# EAGLE design GCtoUSBv1_1 (EAGLE 5.11)
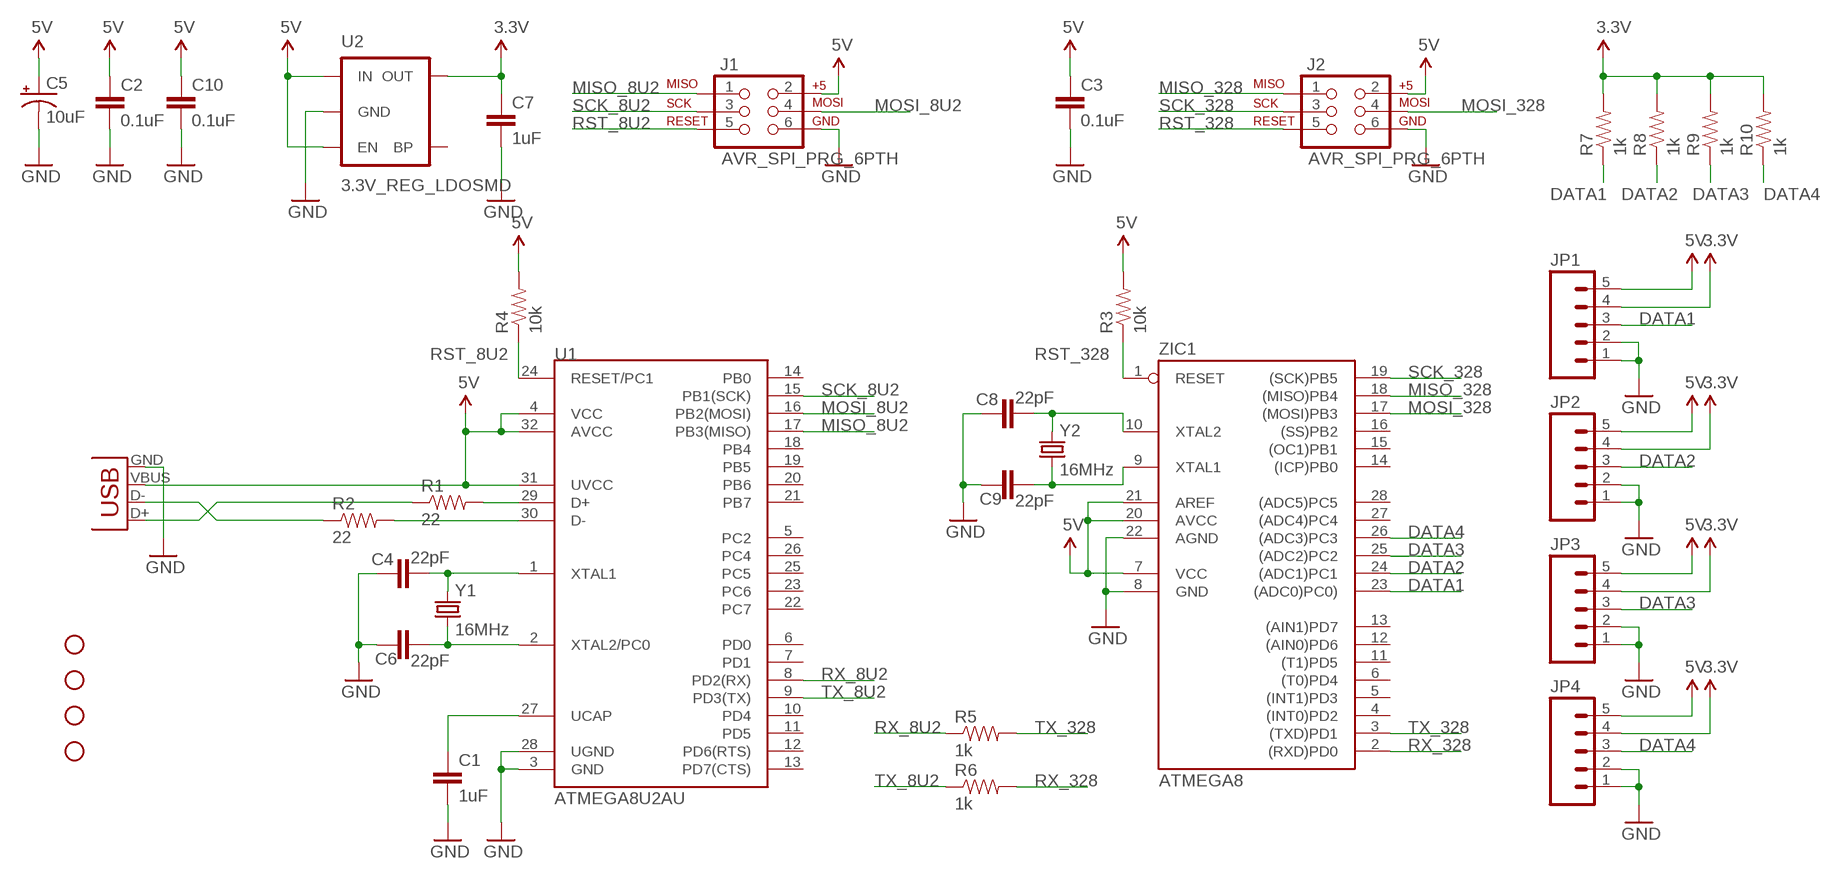
[diagram p0: schematic, sheet 1]

## Parts
C1  1uF  CAPPTH1  [CAP-PTH-5MM]
C2  0.1uF  CAPPTH  [CAP-PTH-SMALL]
C3  0.1uF  CAPPTH  [CAP-PTH-SMALL]
C4  22pF  CAPPTH  [CAP-PTH-SMALL]
C5  10uF  CAP_POLPTH2  [CPOL-RADIAL-10UF-25V]
C6  22pF  CAPPTH  [CAP-PTH-SMALL]
C7  1uF  CAPPTH1  [CAP-PTH-5MM]
C8  22pF  CAPPTH  [CAP-PTH-SMALL]
C9  22pF  CAPPTH  [CAP-PTH-SMALL]
C10  0.1uF  CAPPTH  [CAP-PTH-SMALL]
J1  AVR_SPI_PRG_6PTH  [2X3]
J2  AVR_SPI_PRG_6PTH  [2X3]
JP1  M05PTH  [1X05]
JP2  M05PTH  [1X05]
JP3  M05PTH  [1X05]
JP4  M05PTH  [1X05]
JP5  STAND-OFF  [STAND-OFF]
JP6  STAND-OFF  [STAND-OFF]
JP7  STAND-OFF  [STAND-OFF]
JP8  STAND-OFF  [STAND-OFF]
R1  22  RESISTORPTH-1/4W  [AXIAL-0.4]
R2  22  RESISTORPTH-1/4W  [AXIAL-0.4]
R3  10k  RESISTORPTH-1/2W  [AXIAL-0.5]
R4  10k  RESISTORPTH-1/2W  [AXIAL-0.5]
R5  1k  RESISTORPTH-1/2W  [AXIAL-0.5]
R6  1k  RESISTORPTH-1/2W  [AXIAL-0.5]
R7  1k  RESISTORPTH-1/2W  [AXIAL-0.5]
R8  1k  RESISTORPTH-1/2W  [AXIAL-0.5]
R9  1k  RESISTORPTH-1/2W  [AXIAL-0.5]
R10  1k  RESISTORPTH-1/2W  [AXIAL-0.5]
U1  ATMEGA8U2AU  [TQFP32-08]
U2  3.3V_REG_LDOSMD  V_REG_LDOSMD  [SOT23-5]
X1  USBSMD  [USB-MINIB]
Y1  16MHz  CRYSTALHC49US  [HC49US]
Y2  16MHz  CRYSTALHC49US  [HC49US]
ZIC1  ATMEGA8  AT90S4433P  [DIL28-3]

## Nets
3.3V: C7.1 JP1.4 JP2.4 JP3.4 JP4.4 R7.P$2 R8.P$2 R9.P$2 R10.P$2 U2.5(OUT)
5V: C2.1 C3.1 C5.1(+) C10.1 J1.2 J2.2 JP1.5 JP2.5 JP3.5 JP4.5 R3.P$2 R4.P$2 U1.4(VCC) U1.31(UVCC) U1.32(AVCC) U2.1(IN) U2.3(EN) X1.VBUS ZIC1.7(VCC) ZIC1.20(AVCC) ZIC1.21(AREF)
DATA1: JP1.3 R7.P$1 ZIC1.23((ADC0)PC0))
DATA2: JP2.3 R8.P$1 ZIC1.24((ADC1)PC1)
DATA3: JP3.3 R9.P$1 ZIC1.25((ADC2)PC2)
DATA4: JP4.3 R10.P$1 ZIC1.26((ADC3)PC3)
GND: C1.2 C2.2 C3.2 C4.2 C5.2(-) C6.2 C7.2 C8.2 C9.2 C10.2 J1.6 J2.6 JP1.1 JP1.2 JP2.1 JP2.2 JP3.1 JP3.2 JP4.1 JP4.2 U1.3(GND) U1.28(UGND) U2.2(GND) X1.GND ZIC1.8(GND) ZIC1.22(AGND)
MISO_8U2: J1.1 U1.17(PB3(MISO))
MISO_328: J2.1 ZIC1.18((MISO)PB4)
MOSI_8U2: J1.4 U1.16(PB2(MOSI))
MOSI_328: J2.4 ZIC1.17((MOSI)PB3)
N$1: C8.1 Y2.2 ZIC1.10(XTAL2)
N$2: C9.1 Y2.1 ZIC1.9(XTAL1)
N$3: R1.P$2 U1.29(D+)
N$4: R2.P$2 U1.30(D-)
N$5: R1.P$1 X1.D+
N$6: R2.P$1 X1.D-
N$8: C4.1 U1.1(XTAL1) Y1.2
N$9: C6.1 U1.2(XTAL2/PC0) Y1.1
N$12: C1.1 U1.27(UCAP)
RST_8U2: J1.5 R4.P$1 U1.24(RESET/PC1)
RST_328: J2.5 R3.P$1 ZIC1.1(RESET)
RX_8U2: R5.P$1 U1.8(PD2(RX))
RX_328: R6.P$2 ZIC1.2((RXD)PD0)
SCK_8U2: J1.3 U1.15(PB1(SCK))
SCK_328: J2.3 ZIC1.19((SCK)PB5)
TX_8U2: R6.P$1 U1.9(PD3(TX))
TX_328: R5.P$2 ZIC1.3((TXD)PD1)
Unconnected: U1.5(PC2) U1.6(PD0) U1.7(PD1) U1.10(PD4) U1.11(PD5) U1.12(PD6(RTS)) U1.13(PD7(CTS)) U1.14(PB0) U1.18(PB4) U1.19(PB5) U1.20(PB6) U1.21(PB7) U1.22(PC7) U1.23(PC6) U1.25(PC5) U1.26(PC4) U2.4(BP) ZIC1.4((INT0)PD2) ZIC1.5((INT1)PD3) ZIC1.6((T0)PD4) ZIC1.11((T1)PD5) ZIC1.12((AIN0)PD6) ZIC1.13((AIN1)PD7) ZIC1.14((ICP)PB0) ZIC1.15((OC1)PB1) ZIC1.16((SS)PB2) ZIC1.27((ADC4)PC4) ZIC1.28((ADC5)PC5)

## Library data of the parts
C1-C4 C6-C10 = SparkFun:CAP: Capacitor Standard 0603 ceramic capacitor, and 0.1" leaded capacitor.
C5 = SparkFun:CAP_POL: Capacitor Polarized These are standard SMD and PTH capacitors. Normally 10uF, 47uF, and 100uF in electrolytic and tantalum varieties. Always verify the external diameter of the through hole cap, it varies with capacity, voltage, and manufacturer. The EIA devices should be standard.
J1 J2 = SparkFun:AVR_SPI_PRG_6: AVR ISP 6 Pin This is the reduced ISP connector for AVR programming. Common on Arduino. This footprint will take up less PCB space and can be used with a 10-pin to 6-pin adapter such as SKU: BOB-08508
JP1-JP4 = SparkFun:M05: Header 5 Standard 5-pin 0.1" header. Use with straight break away headers (SKU : PRT-00116), right angle break away headers (PRT-00553), swiss pins (PRT-00743), machine pins (PRT-00117), and female headers (PRT-00115). Molex polarized connector foot print use with SKU : PRT-08230 with associated crimp pins and housings.
JP5-JP8 = SparkFun:STAND-OFF: Stand Off This is the mechanical footprint for a #4 phillips button head screw. Use the keepout ring to avoid running the screw head into surrounding components. SKU : PRT-00447
R1-R10 = SparkFun:RESISTOR: Resistor Basic schematic elements and footprints for 0603, 1206, and PTH resistors.
U1 = SparkFun:ATMEGA8U2: Atmel 8-bit Microcontroller with 8/16/32K Bystes of ISP Flash and USB Controller. ATmega8U2, ATmega16U2, and ATmega32U2
U2 = SparkFun:V_REG_LDO: Voltage Regulator LDO Standard 150mA LDO voltage regulator in SOT-23 layout. Micrel part MIC5205. BP (by-pass) pin is used to lower output noise with 470pF cap.
X1 = SparkFun:USB: USB Connectors USB-B-PTH is fully proven SKU : PRT-00139 USB-miniB is fully proven SKU : PRT-00587 USB-A-PCB is untested. USB-A-H is throughly reviewed, but untested. Spark Fun Electronics SKU : PRT-00437 USB-B-SMT is throughly reviewed, but untested. Needs silkscreen touching up. USB-A-S has not been used/tested USB-MB-H has not been used/tested
Y1 Y2 = SparkFun:CRYSTAL: Crystals Various standard crystals. Proven footprints. Spark Fun Electronics SKU : COM-00534
ZIC1 = atmel:AT90S4433: MICROCONTROLLER 4 Kbytes FLASH 128 bytes SRAM 256 bytes EEPROM UART 6-channel 10 bit ADC

## Net classes
0 default: width 0.203 mm, clearance 0.203 mm

## Board
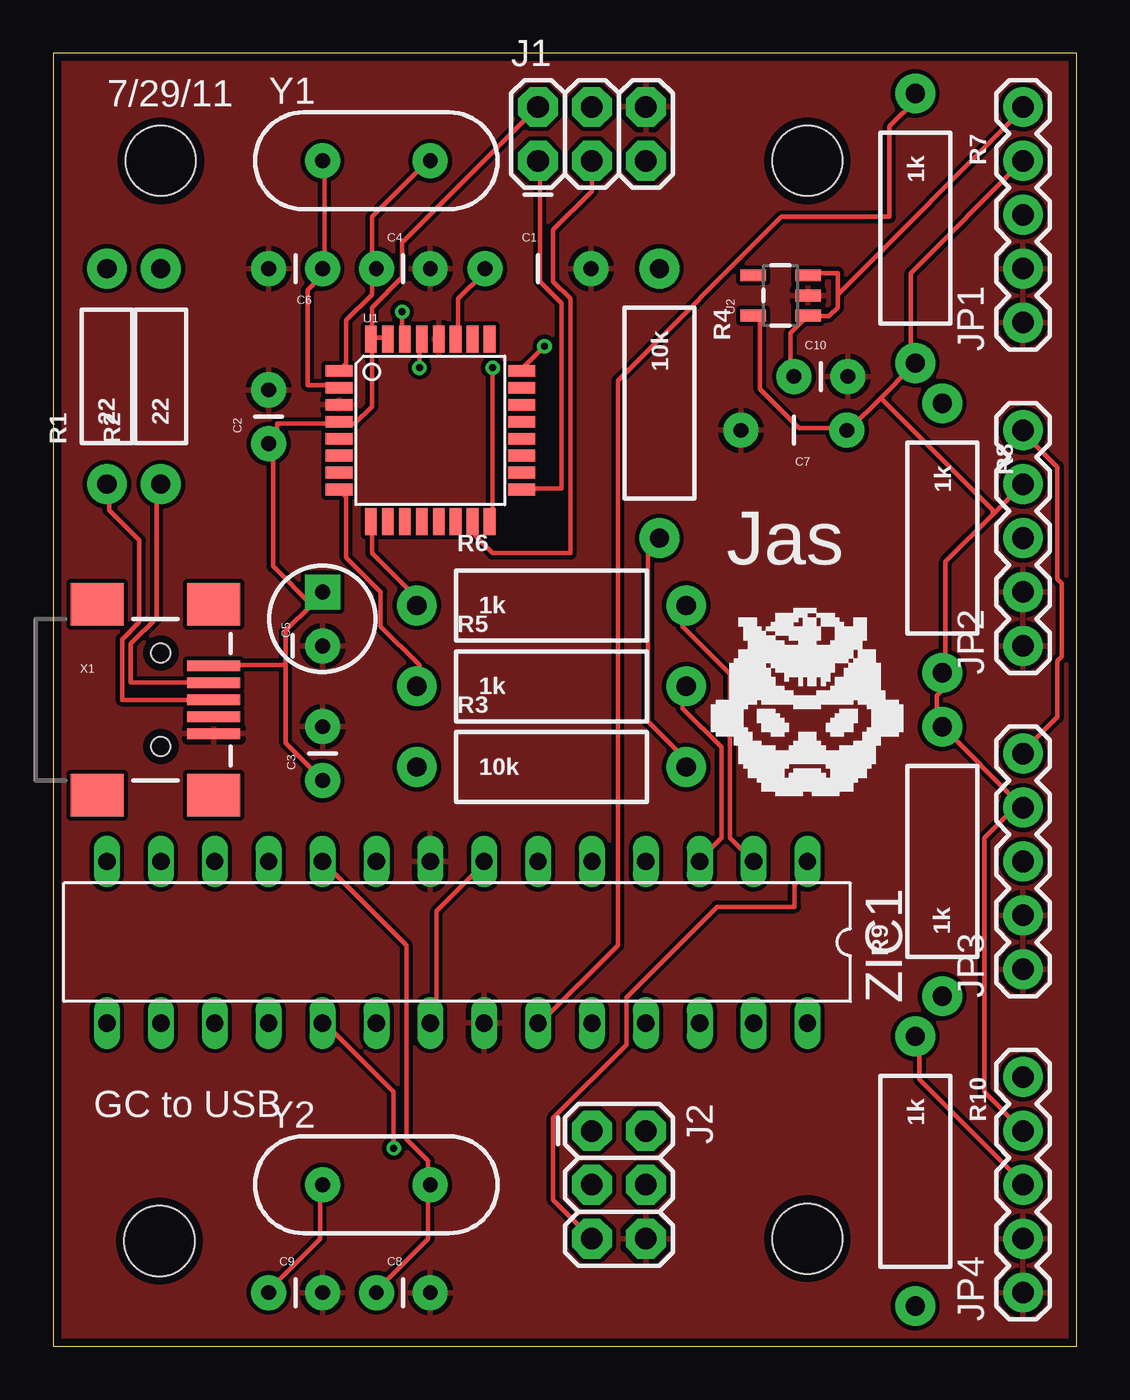
[diagram p1: board, top side]
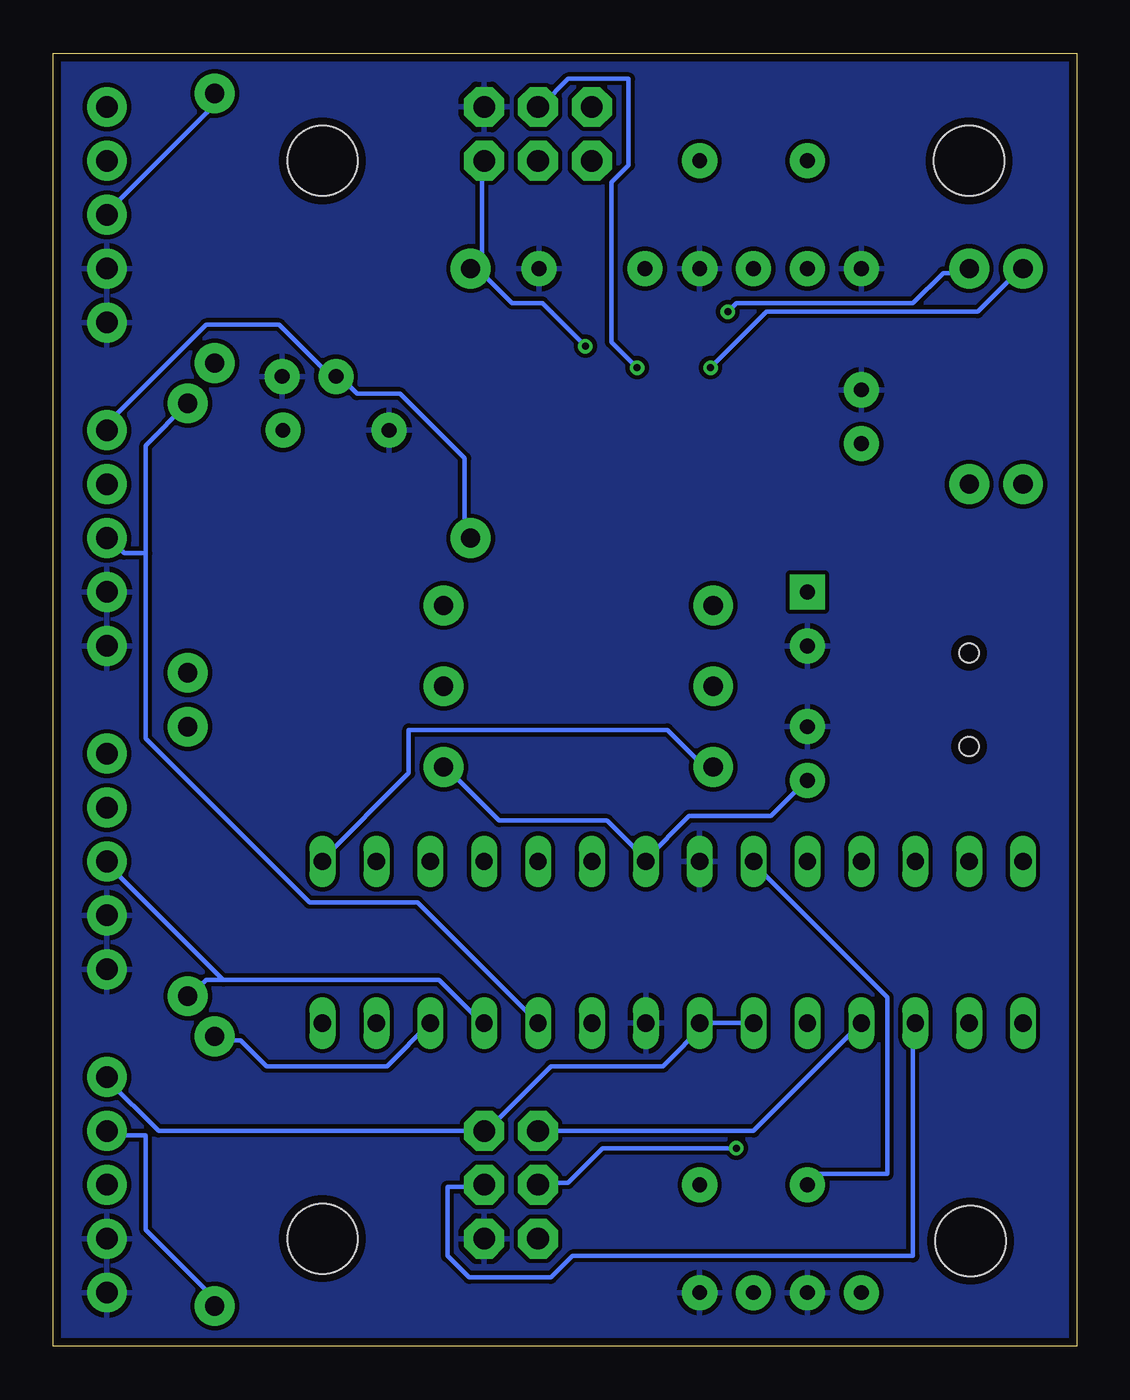
[diagram p2: board, bottom side, seen from below]

Size 48.26 x 60.96 mm. Coordinates in mm from the lower left corner, seen from the top.
Outline: 0,0 48.26,0 48.26,60.96 0,60.96 0,0
Copper layers (1*16): Top 0.0356mm / dielectric 1.5011mm / Bottom 0.0356mm
Design rules "LaenPCBOrder": minimum track width 6mil, minimum drill 13mil, track to track 6mil, track to pad 6mil, pad to pad 6mil, via to via 6mil, smd to smd 6mil, copper to edge 15mil, drill to drill 6mil, minimum pad ring 7mil, minimum via ring 7mil, stop-mask expansion 4mil, vias tented up to drill 0mil, thermal gap 10mil

### Footprints (pad centres in the part's own frame; a part is rotated, then mirrored left to right if it is on the bottom)
CAP-PTH-5MM = drill 0.7 pad 1.651 round: 1 -2.5,0; 2 2.5,0
CAP-PTH-SMALL = drill 0.7 pad 1.651 round: 1 0,0; 2 2.54,0
CPOL-RADIAL-10UF-25V = drill 0.7 pad 1.651 square: 1 1.27,0 | drill 0.7 pad 1.651 round: 2 -1.27,0
2X3 = drill 1.016 pad 1.88 octagon: 1 0,0; 2 0,2.54; 3 2.54,0; 4 2.54,2.54; 5 5.08,0; 6 5.08,2.54
1X05 = drill 1.016 pad 1.88 round: 1 0,0; 2 2.54,0; 3 5.08,0; 4 7.62,0; 5 10.16,0
STAND-OFF = hole 3.302: 0,0
AXIAL-0.4 = drill 0.9 pad 1.88 round: P$1 -5.08,0; P$2 5.08,0
AXIAL-0.5 = drill 0.9 pad 1.88 round: P$1 -6.35,0; P$2 6.35,0
TQFP32-08 = smd 1.27 x 0.559: 1 -4.293,2.8; 2 -4.293,2; 3 -4.293,1.2; 4 -4.293,0.4; 5 -4.293,-0.4; 6 -4.293,-1.2; 7 -4.293,-2; 8 -4.293,-2.8; 17 4.293,-2.8; 18 4.293,-2; 19 4.293,-1.2; 20 4.293,-0.4; 21 4.293,0.4; 22 4.293,1.2; 23 4.293,2; 24 4.293,2.8 | smd 0.559 x 1.27: 9 -2.8,-4.293; 10 -2,-4.293; 11 -1.2,-4.293; 12 -0.4,-4.293; 13 0.4,-4.293; 14 1.2,-4.293; 15 2,-4.293; 16 2.8,-4.293; 25 2.8,4.293; 26 2,4.293; 27 1.2,4.293; 28 0.4,4.293; 29 -0.4,4.293; 30 -1.2,4.293; 31 -2,4.293; 32 -2.8,4.293
SOT23-5 = smd 0.55 x 1.2: 1 -0.95,-1.3; 2 0,-1.3; 3 0.95,-1.3; 4 0.95,1.3; 5 -0.95,1.3
USB-MINIB = smd 2.5 x 0.5: D+ 2.5,0; D- 2.5,0.8; GND 2.5,-1.6; ID 2.5,-0.8; VBUS 2.5,1.6 | smd 2.5 x 2: MTN1 -3,4.5; MTN2 2.5,4.5; MTN3 -3,-4.5; MTN4 2.5,-4.5 | hole 0.9: 0,2.2; 0,-2.2
HC49US = drill 0.7 pad 1.651 round: 1 -2.54,0; 2 2.54,0
DIL28-3 = drill 0.813 long: 1 -16.51,-3.81; 2 -13.97,-3.81; 3 -11.43,-3.81; 4 -8.89,-3.81; 5 -6.35,-3.81; 6 -3.81,-3.81; 7 -1.27,-3.81; 8 1.27,-3.81; 9 3.81,-3.81; 10 6.35,-3.81; 11 8.89,-3.81; 12 11.43,-3.81; 13 13.97,-3.81; 14 16.51,-3.81; 15 16.51,3.81; 16 13.97,3.81; 17 11.43,3.81; 18 8.89,3.81; 19 6.35,3.81; 20 3.81,3.81; 21 1.27,3.81; 22 -1.27,3.81; 23 -3.81,3.81; 24 -6.35,3.81; 25 -8.89,3.81; 26 -11.43,3.81; 27 -13.97,3.81; 28 -16.51,3.81

### Placement (x,y rotation side)
C1  22.86,50.8 0 top
C2  10.16,42.55 90 top
C3  12.7,26.67 90 top
C4  15.24,50.8 0 top
C5  12.7,34.29 90 top
C6  12.7,50.8 180 top
C7  34.92,43.18 180 top
C8  15.24,2.54 0 top
C9  10.16,2.54 0 top
C10  34.92,45.72 0 top
J1  22.86,55.88 0 top
J2  25.4,10.16 270 top
JP1  45.72,48.26 90 top
JP2  45.72,33.02 90 top
JP3  45.72,17.78 90 top
JP4  45.72,2.54 90 top
JP5  5.02,4.97 0 top
JP6  35.56,5.08 0 top
JP7  5.08,55.88 0 top
JP8  35.56,55.88 0 top
R1  2.54,45.72 90 top
R2  5.08,45.72 90 top
R3  23.5,27.3 0 top
R4  28.57,44.45 270 top
R5  23.5,31.11 0 top
R6  23.5,34.92 0 top
R7  40.64,52.7 270 top
R8  41.91,38.1 270 top
R9  41.91,22.86 90 top
R10  40.64,8.26 270 top
U1  17.78,43.18 0 top
U2  34.29,49.53 90 top
X1  5.08,30.48 0 top
Y1  15.24,55.88 0 top
Y2  15.24,7.62 0 top
ZIC1  19.05,19.05 180 top

### Tracks (layer width: path | path; a pad name or v marks a point on that pad's centre or on a via)
3.3V
  Top 0.203: U2.5 33.12,48.56 33.33,48.36 33.33,45.11 35.15,43.28 37.39,43.28 C7.1 37.59,43.28 39.01,44.7 | 39.01,44.7 40.44,46.13 | 40.44,46.13 40.64,46.33 R7.P$2 40.44,46.13 | JP1.4 40.44,50.6 40.44,46.13 | 45.52,25.6 R9.P$2 41.66,29.46 41.66,30.68 42.06,31.09 42.06,31.7 R8.P$2 42.06,31.9 42.06,36.98 44.3,39.22 | 44.3,39.22 JP2.4 | JP4.4 43.89,11.99 43.89,23.98 45.52,25.6 | 45.52,25.6 JP3.4 | 39.01,44.7 44.3,39.42 44.3,39.22
  Bottom 0.203: JP4.4 45.52,9.96 43.89,9.96 43.89,5.49 41.05,2.64 40.64,2.64 R10.P$2
5V
  Top 0.203: 10.97,32.11 7.72,32.11 X1.VBUS | 10.97,32.11 10.97,33.73 12.19,34.95 | 12.19,34.95 12.6,35.36 12.6,35.56 C5.1 12.19,34.95 | 10.97,32.11 10.97,28.45 12.6,26.82 C3.1 | 15.04,47.55 15.65,47.55 U1.31 | 10.36,42.88 10.16,42.67 C2.1 10.36,42.88 | 10.36,42.88 10.57,43.08 10.57,43.48 13.41,43.48 U1.4 13.61,43.48 14.22,43.48 15.04,44.3 15.04,47.35 U1.32 15.04,47.55 | 15.04,47.55 15.04,48.97 16.46,50.39 16.46,52.02 J1.2 | 12.19,34.95 10.36,36.78 10.36,42.88 | JP3.5 45.72,28.04 47.35,29.67 47.35,32.31 47.55,32.51 47.55,35.97 47.35,36.17 47.35,41.45 45.72,43.08 JP2.5 | C10.1 34.75,45.72 34.75,47.75 35.56,48.56 U2.1 35.76,48.56 36.58,48.56 36.98,48.97 36.98,49.58 | 36.98,49.58 36.98,50.6 35.76,50.6 U2.3 | 36.98,49.58 45.72,58.32 JP1.5 | ZIC1.7 20.32,22.76 18.09,20.52 18.09,15.44 17.88,15.24 ZIC1.21 | R4.P$2 28.45,38 28.04,37.59 28.04,29.46 29.67,27.84 29.67,27.43 R3.P$2
  Bottom 0.203: JP2.5 45.72,43.89 45.31,43.89 41.05,48.16 37.59,48.16 35.15,45.72 C10.1 34.75,45.72 33.93,44.91 31.9,44.91 28.85,41.86 28.85,38.2 28.65,38.2 R4.P$2 | ZIC1.20 17.48,15.24 | 17.48,15.24 ZIC1.21 17.68,15.24 | 17.48,15.24 19.51,13.21 24.79,13.21 27.84,10.16 J2.2 43.28,10.16 45.72,12.6 JP4.5 | 20.32,22.96 22.15,24.79 27.23,24.79 29.67,27.23 R3.P$2 | 20.32,22.96 18.29,24.99 14.43,24.99 12.8,26.62 C3.1 | ZIC1.7 20.32,22.96
DATA1
  Top 0.203: ZIC1.23 22.96,15.24 26.62,18.9 26.62,45.52 34.34,53.24 39.42,53.24 39.42,57.51 40.64,58.73 R7.P$1
  Bottom 0.203: JP1.3 45.72,53.44 40.64,58.52 R7.P$1
DATA2
  Bottom 0.203: ZIC1.24 31.09,20.93 36.17,20.93 43.89,28.65 43.89,37.39 | 43.89,37.39 44.91,37.39 45.52,38 45.72,38 JP2.3 | 43.89,37.39 43.89,42.47 R8.P$1
DATA3
  Bottom 0.203: 40.23,17.27 41.05,17.27 41.66,16.66 41.86,16.66 R9.P$1 | 40.23,17.27 30.07,17.27 28.04,15.24 ZIC1.25 | 40.23,17.27 45.72,22.76 JP3.3
DATA4
  Top 0.203: JP4.3 45.72,7.72 40.84,12.6 40.84,14.22 40.64,14.43 R10.P$1
  Bottom 0.203: ZIC1.26 32.51,13.21 38.2,13.21 39.42,14.43 40.64,14.43 R10.P$1
GND
  pour Top: 0,0 0,60.96 48.26,60.96 48.26,0
  pour Bottom: 0,0 0,60.96 48.26,60.96 48.26,0
MISO_8U2
  Top 0.203: U1.17 22.15,40.44 23.98,40.44 23.98,49.17 22.96,50.19 22.96,55.88 J1.1
MISO_328
  Bottom 0.203: ZIC1.18 15.24,10.16 J2.1
MOSI_8U2  (via drill 0.33)
  Top 0.203: v20.73,46.13 20.73,39.01 U1.16
  Bottom 0.203: v20.73,46.13 21.95,47.35 21.95,54.86 21.13,55.68 21.13,59.74 23.98,59.74 25.2,58.52 25.4,58.52 J1.4
MOSI_328
  Bottom 0.203: ZIC1.17 7.72,15.24 7.72,4.27 23.77,4.27 24.79,3.25 28.65,3.25 29.67,4.27 29.67,7.52 28.04,7.52 J2.4
N$1
  Top 0.203: ZIC1.10 16.66,18.9 16.66,9.75 17.68,8.74 17.68,7.72 Y2.2 17.68,7.52 17.68,5.08 15.24,2.64 C8.1
N$2
  Top 0.203: C9.1 10.16,2.64 12.6,5.08 12.6,7.52 Y2.1
  Bottom 0.203: ZIC1.9 15.24,22.76 8.94,16.46 8.94,8.13 12.19,8.13 Y2.1
N$3  (via drill 0.33)
  Top 0.203: v17.27,46.13 17.27,47.35 U1.29
  Bottom 0.203: v17.27,46.13 14.63,48.77 4.67,48.77 2.64,50.8 R1.P$2
N$4  (via drill 0.33)
  Top 0.203: v16.46,48.77 16.46,47.55 U1.30
  Bottom 0.203: v16.46,48.77 16.05,49.17 7.72,49.17 6.3,50.6 5.28,50.6 R2.P$2
N$5
  Top 0.203: X1.D+ 3.25,30.48 3.25,33.33 4.06,34.14 4.06,38 2.64,39.42 2.64,40.64 R1.P$1
N$6
  Top 0.203: R2.P$1 4.88,40.44 4.88,34.34 3.66,33.12 3.66,31.29 7.52,31.29 X1.D-
N$8
  Top 0.203: 15.04,50.6 15.04,49.58 13.82,48.36 13.82,46.33 13.61,46.13 U1.1 | 15.04,50.6 15.04,53.24 17.68,55.88 Y1.2 | 15.04,50.6 C4.1
N$9
  Top 0.203: U1.2 13.41,45.31 11.99,45.31 11.99,49.78 12.6,50.39 12.6,50.8 C6.1 12.8,50.8 12.8,55.88 Y1.1
N$12
  Top 0.203: U1.27 19.1,47.55 19.1,49.38 20.32,50.6 20.32,50.8 C1.1
RST_8U2  (via drill 0.33)
  Top 0.203: v23.16,47.14 22.15,46.13 U1.24
  Bottom 0.203: v23.16,47.14 25.2,49.17 26.62,49.17 28.25,50.8 | 28.25,50.8 R4.P$1 28.45,50.8 | 28.25,50.8 28.04,50.8 28.04,55.88 J1.5
RST_328
  Top 0.203: J2.5 23.57,6.91 23.57,10.77 27.03,14.22 27.03,16.46 31.29,20.73 34.95,20.73 34.95,21.74 35.56,22.35 ZIC1.1
  Bottom 0.203: ZIC1.1 35.56,22.96 31.5,27.03 31.5,29.06 19.3,29.06 17.68,27.43 17.27,27.43 R3.P$1
RX_8U2
  Top 0.203: U1.8 13.61,40.23 13.82,40.03 13.82,37.19 15.44,35.56 15.44,33.93 17.27,32.11 17.27,31.29 R5.P$1
RX_328
  Top 0.203: ZIC1.2 31.9,23.98 31.9,31.7 29.67,33.93 29.67,34.75 R6.P$2
SCK_8U2
  Top 0.203: J1.3 25.4,54.46 23.57,52.63 23.57,50.19 24.38,49.38 24.38,37.39 20.73,37.39 19.91,38.2 19.91,38.81 U1.15
SCK_328  (via drill 0.33)
  Top 0.203: v16.05,9.35 16.05,11.99 12.8,15.24 ZIC1.19
  Bottom 0.203: v16.05,9.35 22.35,9.35 23.98,7.72 25.4,7.72 J2.3
TX_8U2
  Top 0.203: U1.9 15.04,38.81 15.04,37.39 17.07,35.36 17.07,34.95 R6.P$1
TX_328
  Top 0.203: ZIC1.3 30.48,22.96 31.5,23.98 31.5,28.25 29.67,30.07 29.67,31.09 R5.P$2

### Text on the board
tPlace: 7/29/11 | Jas | GC to USB